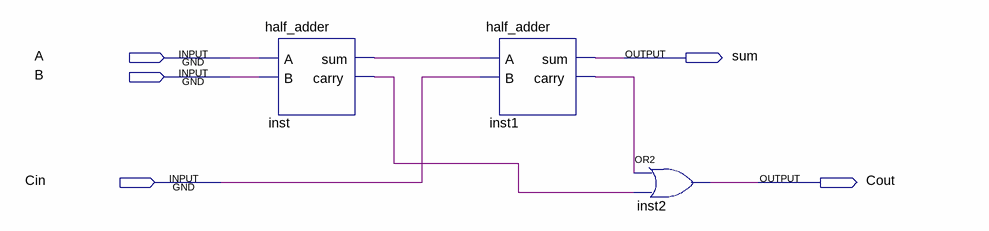
[diagram p0: schematic sheet]
// Quartus schematic full_adder.bdf as structural Verilog: 3 symbols, 5 pins
module full_adder (
  input  A,
  input  B,
  input  Cin,
  output sum,
  output Cout
);

  wire inst1_carry, inst_carry, inst_sum;

  half_adder inst (.A(A), .B(B), .sum(inst_sum), .carry(inst_carry));
  half_adder inst1 (.A(inst_sum), .B(Cin), .sum(sum), .carry(inst1_carry));
  or inst2 (Cout, inst1_carry, inst_carry);
endmodule
